# EAGLE design tvbgone11 (EAGLE 5.12)
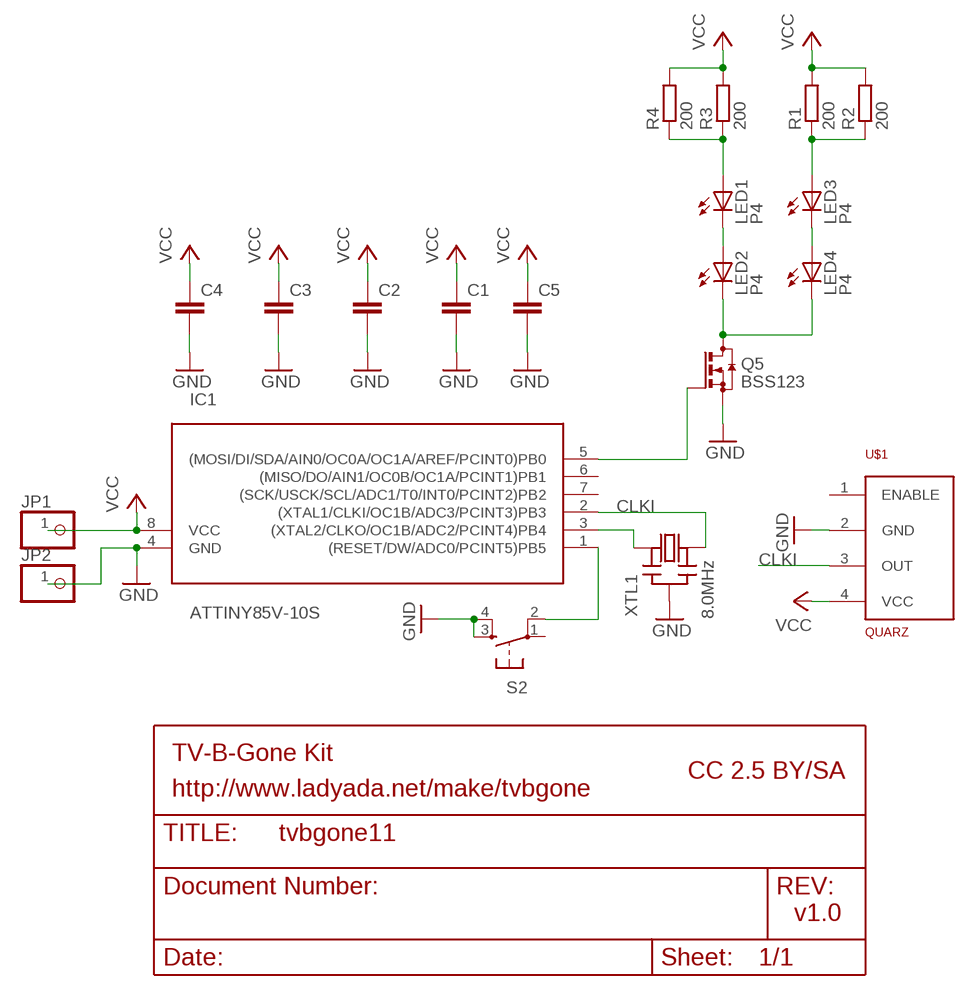
[diagram p0: schematic, sheet 1]

## Parts
C1  C-EUC1206  [C1206]
C2  C-EUC1206  [C1206]
C3  C-EUC1206  [C1206]
C4  C-EUC1206  [C1206]
C5  C-EUC1206  [C1206]
IC1  ATTINY85V-10S  [SOIC8]
JP1  PINHD-1X1  [1X01]
JP2  PINHD-1X1  [1X01]
LED1  P4  [LED5MM]
LED2  P4  [LED5MM]
LED3  P4  [LED5MM]
LED4  P4  [LED5MM]
Q5  BSS123  [SOT23]
R1  200  R-EU_R1206  [R1206]
R2  200  R-EU_R1206  [R1206]
R3  200  R-EU_R1206  [R1206]
R4  200  R-EU_R1206  [R1206]
S2  10-XXA  [TASTER]
U$1  QUARZ  [QUARZ]
XTL1  8.0MHz  CERMOSCILL  [CERM_OSC]

## Nets
CLKI: IC1.2((XTAL1/CLKI/OC1B/ADC3/PCINT3)PB3) U$1.3(OUT) XTL1.P$3(OUT)
GND: C1.2 C2.2 C3.2 C4.2 C5.2 IC1.4(GND) JP2.1 Q5.1(S) S2.3(S) S2.4(S1) U$1.2(GND) XTL1.P$2(GND)
N$1: IC1.3((XTAL2/CLKO/OC1B/ADC2/PCINT4)PB4) XTL1.P$1(IN)
N$2: IC1.1((RESET/DW/ADC0/PCINT5)PB5) S2.2(P1)
N$3: LED1.K(C) LED2.A
N$4: IC1.5((MOSI/DI/SDA/AIN0/OC0A/OC1A/AREF/PCINT0)PB0) Q5.3(G)
N$5: LED2.K(C) LED4.K(C) Q5.2(D)
N$7: LED1.A R3.1 R4.1
N$8: LED3.A R1.1 R2.1
N$9: LED3.K(C) LED4.A
VCC: C1.1 C2.1 C3.1 C4.1 C5.1 IC1.8(VCC) JP1.1 R1.2 R2.2 R3.2 R4.2 U$1.4(VCC)
Unconnected: IC1.6((MISO/DO/AIN1/OC0B/OC1A/PCINT1)PB1) IC1.7((SCK/USCK/SCL/ADC1/T0/INT0/PCINT2)PB2) S2.1(P) U$1.1(ENABLE)

## Notes on the sheet
- TV-B-Gone Kit
- CC 2.5 BY/SA
- http://www.ladyada.net/make/tvbgone
- v1.0

## Library data of the parts
C1-C5 = rcl:C-EU: CAPACITOR, European symbol
IC1 = avr:ATTINY85: MICROCONTROLLER 8 Kbytes FLASH 512 bytes EEPROM 512 bytes RAM 4-channel 10 bit ADC USI
JP1 JP2 = pinhead:PINHD-1X1: PIN HEADER
LED1-LED4 = smd-dil.led:*P4: PointLED® Enhanced Thinfilm LED TOP & BOTTOM mount LS P47F, LR P47F, LA P47F, LY P47F, LT P4SG, LB P4SG, LW P4SG Source: http://catalog.osram-os.com .. LA_LR_LS_LY_P47F_Pb_free.pdf
Q5 = n-ch-transistor:BSS123: N-CHANNEL MOS FET
R1-R4 = rcl:R-EU_: RESISTOR, European symbol
S2 = smd-taster:10-XX: OMRON SWITCH
U$1 = smd-quarz:QUARZ
XTL1 = digg:CERMOSCILL

## Board
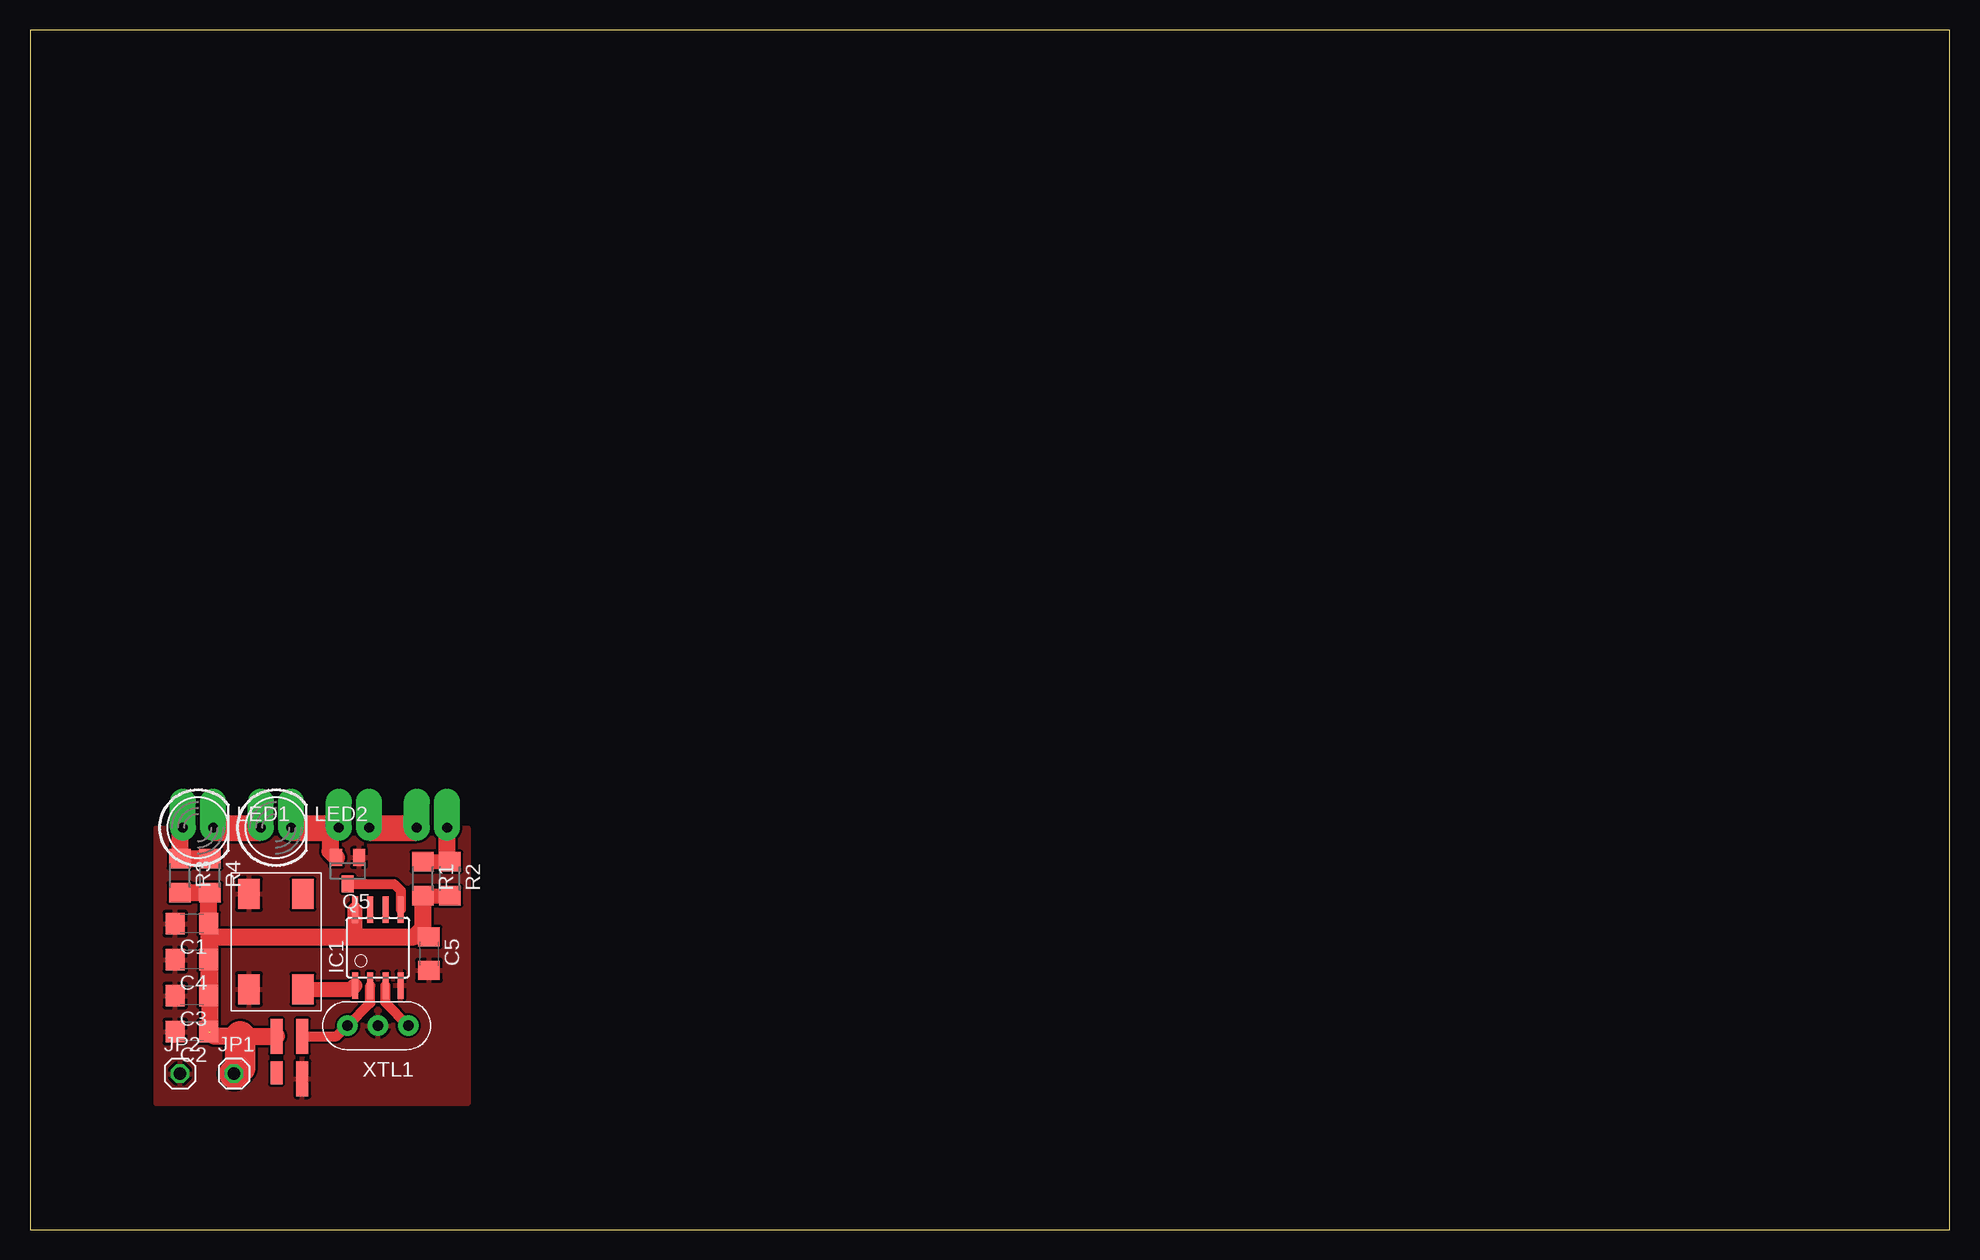
[diagram p1: board, top side]
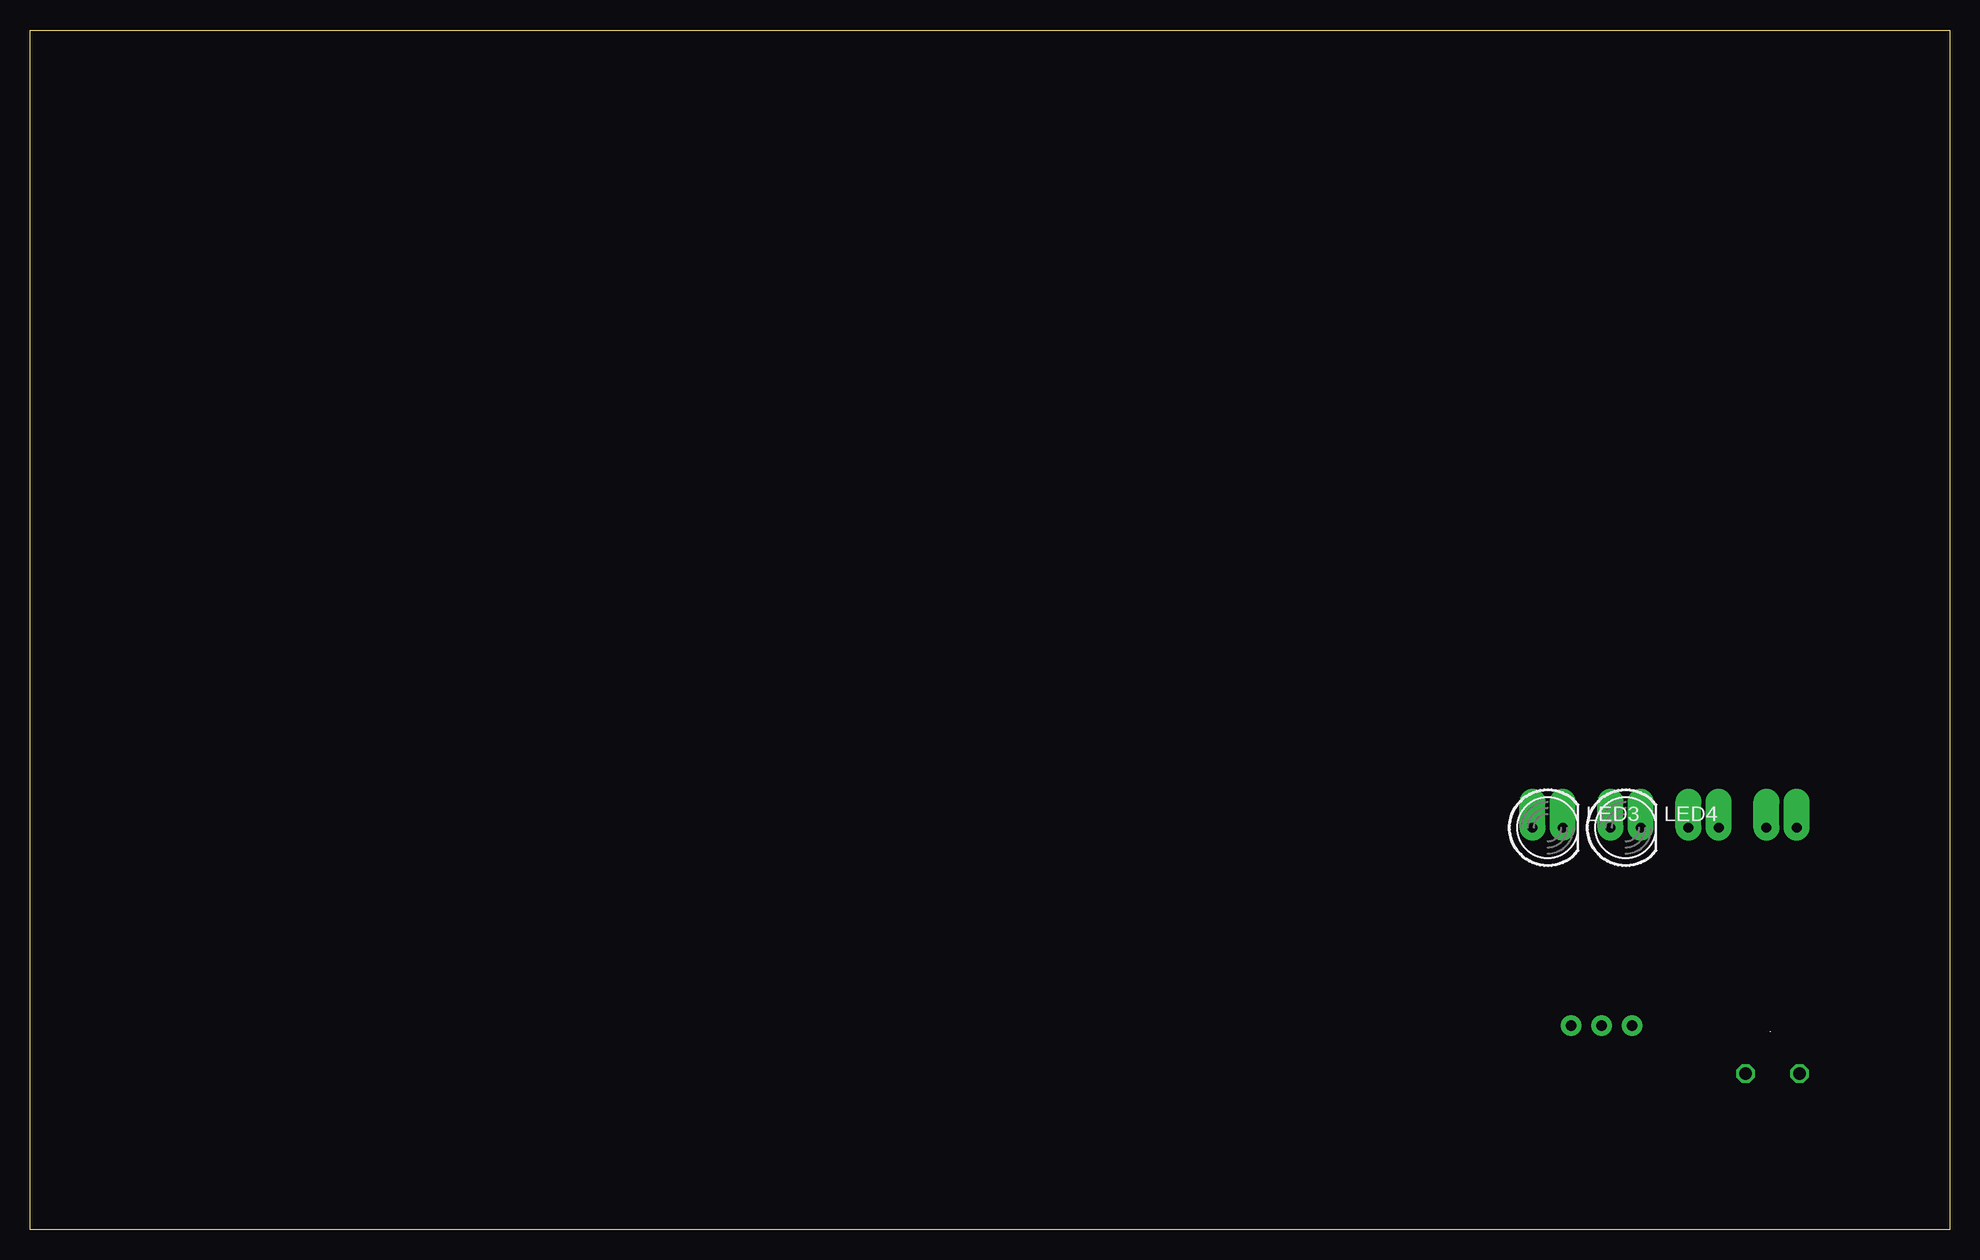
[diagram p2: board, bottom side, seen from below]

Size 160 x 100 mm. Coordinates in mm from the lower left corner, seen from the top.
Outline: 0,0 160,0 160,100 0,100 0,0
Copper layers (1*16): Top 0.035mm / dielectric 1.5mm / Bottom 0.035mm
Design rules "default": minimum track width 10mil, minimum drill 24mil, track to track 8mil, track to pad 8mil, pad to pad 8mil, via to via 8mil, smd to smd 8mil, copper to edge 40mil, drill to drill 8mil, minimum pad ring 10mil, minimum via ring 8mil, stop-mask expansion 4mil, vias tented up to drill 0mil, thermal gap 10mil

### Footprints (pad centres in the part's own frame; a part is rotated, then mirrored left to right if it is on the bottom)
C1206 = smd 1.6 x 1.8: 1 -1.4,0; 2 1.4,0
SOIC8 = smd 0.5 x 2.2: 1 -1.905,-3.154; 2 -0.645,-3.154; 3 0.625,-3.154; 4 1.895,-3.154; 5 1.905,3.154; 6 0.635,3.154; 7 -0.635,3.154; 8 -1.905,3.154
1X01 = drill 1.016 octagon: 1 0,0
LED5MM = drill 0.813 pad 2.184 offset: A -1.27,0; K 1.27,0
SOT23 = smd 1 x 1.4: 1 -0.95,-1.1; 2 0.95,-1.1; 3 0,1.1
R1206 = smd 1.6 x 1.803: 1 -1.422,0; 2 1.422,0
TASTER = smd 2.5 x 1.8: 1 -3.975,2.25; 2 3.975,2.25; 3 -3.975,-2.25; 4 3.975,-2.25
QUARZ = smd 1 x 1.9: 1 -1.075,-1.275 | smd 1 x 2.9: 2 1.075,-1.775; 3 1.075,1.775; 4 -1.075,1.775
CERM_OSC = drill 0.9 pad 1.676 round: P$1 -2.54,0; P$2 0,0; P$3 2.54,0

### Placement (x,y rotation side)
C1  13.5,25.5 180 top
C2  13.5,16.5 180 top
C3  13.5,19.5 180 top
C4  13.5,22.5 180 top
C5  33.25,23 270 top
IC1  29,23.5 0 top
JP1  17,13 0 top
JP2  12.5,13 0 top
LED1  14,33.5 0 top
LED2  20.5,33.5 0 top
LED3  33.5,33.5 0 bottom
LED4  27,33.5 0 bottom
Q5  26.48,29.91 180 top
R1  32.75,29.25 270 top
R2  35,29.25 270 top
R3  12.5,29.5 270 top
R4  15,29.5 270 top
S2  20.5,24 270 top
U$1  21.63,14.33 0 top
XTL1  29,17 180 top

### Tracks (layer width: path | path; a pad name or v marks a point on that pad's centre or on a via)
CLKI
  Top 0.813: IC1.2 28.36,18.89 XTL1.P$3 25.57,16.11 U$1.3
GND
  pour Top: 10.5,33.5 36.5,33.5 36.5,10.5 10.5,10.5
N$1
  Top 0.813: IC1.3 29.62,18.91 XTL1.P$1
N$2
  Top 1.27: S2.2 26.77,20.02 IC1.1
N$3
  Top 2.184: LED1.K LED2.A
N$4
  Top 0.813: Q5.3 30.35,28.81 30.91,28.25 IC1.5
N$5
  Top 1.422: Q5.2 25,31.54 25,33.5
  Top 2.184: LED2.K 25,33.5 LED4.K
N$7
  Top 1.422: LED1.A 12.5,33.27 R3.1 R4.1
N$8
  Top 1.27: R1.1 R2.1
  Top 1.422: R2.1 34.77,30.9 LED3.A
N$9
  Top 2.184: LED4.A LED3.K
VCC  (1 unrouted)
  Top 0.4: 17.5,16.11 17,16.11
  Top 1.27: 15,25.4 C1.1 | 15,24 15,25.4 | 15,25.4 15,25.5 14.9,25.4 | 14.9,27.98 R4.2 | R1.2 R2.2 | 32,24.4 C5.1 | IC1.8 27.09,24.5 27,24.4
  Top 1.422: U$1.4 17,16.11 15.39,16.11 15,16.5 15,24 15.4,24.4 27,24.4 32,24.4 32.75,25.15 R1.2 | 14.9,25.4 C4.1 C3.1 | R4.2 R3.2 | C1.1 14.9,27.98
  Top 2.54: 17.5,16.11 17.5,13.5 JP1.1